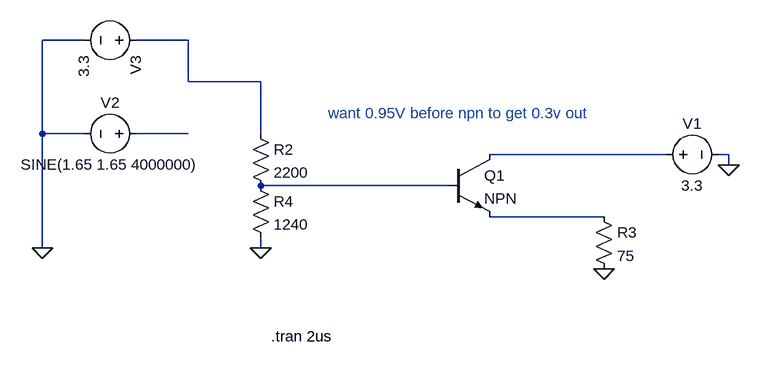
[diagram p0: schematic trans_conv-300mV-pre-npn.asc]
trans_conv-300mV-pre-npn.asc, the LTspice schematic file:
Version 4
SHEET 1 880 680
WIRE -480 -64 -544 -64
WIRE -320 -64 -400 -64
WIRE -320 0 -320 -64
WIRE -208 0 -320 0
WIRE -544 80 -544 -64
WIRE -480 80 -544 80
WIRE -320 80 -400 80
WIRE -208 80 -208 0
WIRE 416 112 144 112
WIRE 512 112 496 112
WIRE 512 128 512 112
WIRE 80 160 -208 160
WIRE 320 208 144 208
WIRE -544 256 -544 80
WIRE -208 256 -208 240
FLAG -208 256 0
FLAG 512 128 0
FLAG 320 288 0
FLAG -544 256 0
SYMBOL voltage 400 112 R270
WINDOW 0 32 56 VTop 2
WINDOW 3 -32 56 VBottom 2
WINDOW 123 0 0 Left 2
WINDOW 39 0 0 Left 2
SYMATTR InstName V1
SYMATTR Value 3.3
SYMBOL voltage -384 80 R90
WINDOW 0 -32 56 VBottom 2
WINDOW 3 32 56 VTop 2
WINDOW 123 0 0 Left 2
WINDOW 39 0 0 Left 2
SYMATTR InstName V2
SYMATTR Value SINE(1.65 1.65 4000000)
SYMBOL npn 80 112 R0
SYMATTR InstName Q1
SYMBOL res 304 192 R0
SYMATTR InstName R3
SYMATTR Value 75
SYMBOL res -224 64 R0
SYMATTR InstName R2
SYMATTR Value 2200
SYMBOL res -224 144 R0
SYMATTR InstName R4
SYMATTR Value 1240
SYMBOL voltage -384 -64 R90
WINDOW 123 0 0 Left 2
WINDOW 39 0 0 Left 2
SYMATTR InstName V3
SYMATTR Value 3.3
TEXT -192 392 Left 2 !.tran 2us
TEXT -104 48 Left 2 ;want 0.95V before npn to get 0.3v out

The netlist it stands for:
* trans_conv-300mV-pre-npn.asc
V1 N003 0 3.3
V2 N002 0 SINE(1.65 1.65 4000000)
Q1 N003 N004 N005 0 NPN
R3 N005 0 75
R2 N001 N004 2200
R4 N004 0 1240
V3 N001 0 3.3
.model NPN NPN
.model PNP PNP
.lib standard.bjt
.tran 2us
* want 0.95V before npn to get 0.3v out
.backanno
.end